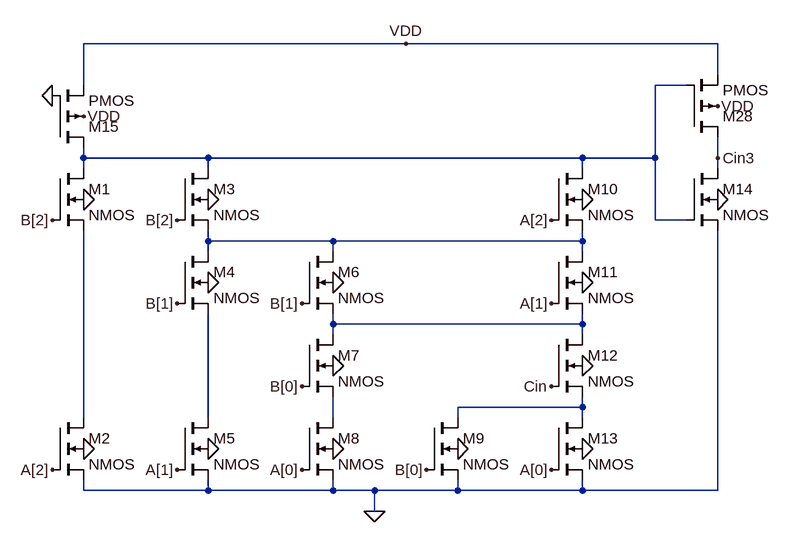
[diagram p0: schematic Carry_in3.asc]
Carry_in3.asc, the LTspice schematic file:
Version 4
SHEET 1 1284 680
WIRE 704 -320 208 -320
WIRE 1184 -320 704 -320
WIRE 1184 -272 1184 -320
WIRE 208 -256 208 -320
WIRE 1136 -256 1088 -256
WIRE 208 -144 208 -160
WIRE 400 -144 208 -144
WIRE 976 -144 400 -144
WIRE 1088 -144 1088 -256
WIRE 1088 -144 976 -144
WIRE 1184 -144 1184 -176
WIRE 208 -128 208 -144
WIRE 400 -128 400 -144
WIRE 976 -128 976 -144
WIRE 1184 -128 1184 -144
WIRE 1088 -48 1088 -144
WIRE 1136 -48 1088 -48
WIRE 400 -16 400 -32
WIRE 592 -16 400 -16
WIRE 976 -16 976 -32
WIRE 976 -16 592 -16
WIRE 400 0 400 -16
WIRE 592 0 592 -16
WIRE 976 0 976 -16
WIRE 592 112 592 96
WIRE 976 112 976 96
WIRE 976 112 592 112
WIRE 592 128 592 112
WIRE 976 128 976 112
WIRE 976 240 976 224
WIRE 976 240 784 240
WIRE 208 256 208 -32
WIRE 400 256 400 96
WIRE 592 256 592 224
WIRE 784 256 784 240
WIRE 976 256 976 240
WIRE 208 368 208 352
WIRE 400 368 400 352
WIRE 400 368 208 368
WIRE 592 368 592 352
WIRE 592 368 400 368
WIRE 656 368 592 368
WIRE 784 368 784 352
WIRE 784 368 656 368
WIRE 976 368 976 352
WIRE 976 368 784 368
WIRE 1184 368 1184 -32
WIRE 1184 368 976 368
WIRE 656 400 656 368
FLAG 976 304 0
FLAG 976 176 0
FLAG 976 48 0
FLAG 976 -80 0
FLAG 1184 -80 0
FLAG 784 304 0
FLAG 592 304 0
FLAG 592 176 0
FLAG 592 48 0
FLAG 400 48 0
FLAG 400 -80 0
FLAG 400 304 0
FLAG 208 304 0
FLAG 208 -80 0
FLAG 1184 -224 VDD
FLAG 656 400 0
FLAG 928 336 A[0]
FLAG 544 336 A[0]
FLAG 928 80 A[1]
FLAG 352 336 A[1]
FLAG 160 336 A[2]
FLAG 928 -48 A[2]
FLAG 736 336 B[0]
FLAG 544 208 B[0]
FLAG 544 80 B[1]
FLAG 352 80 B[1]
FLAG 352 -48 B[2]
FLAG 160 -48 B[2]
FLAG 928 208 Cin
FLAG 1184 -144 Cin3
FLAG 704 -320 VDD
FLAG 208 -208 VDD
FLAG 160 -240 0
SYMBOL nmos4 160 -128 R0
SYMATTR InstName M1
SYMBOL nmos4 160 256 R0
SYMATTR InstName M2
SYMBOL nmos4 352 -128 R0
SYMATTR InstName M3
SYMBOL nmos4 352 0 R0
SYMATTR InstName M4
SYMBOL nmos4 352 256 R0
SYMATTR InstName M5
SYMBOL nmos4 544 0 R0
SYMATTR InstName M6
SYMBOL nmos4 544 128 R0
SYMATTR InstName M7
SYMBOL nmos4 544 256 R0
SYMATTR InstName M8
SYMBOL nmos4 736 256 R0
SYMATTR InstName M9
SYMBOL nmos4 928 -128 R0
SYMATTR InstName M10
SYMBOL nmos4 928 0 R0
SYMATTR InstName M11
SYMBOL nmos4 928 128 R0
SYMATTR InstName M12
SYMBOL nmos4 928 256 R0
SYMATTR InstName M13
SYMBOL nmos4 1136 -128 R0
SYMATTR InstName M14
SYMBOL pmos4 160 -160 M180
SYMATTR InstName M15
SYMBOL pmos4 1136 -176 M180
SYMATTR InstName M28

The netlist it stands for:
* Carry_in3.asc
M1 N001 B[2] N005 0 NMOS
M2 N005 A[2] 0 0 NMOS
M3 N001 B[2] N002 0 NMOS
M4 N002 B[1] N006 0 NMOS
M5 N006 A[1] 0 0 NMOS
M6 N002 B[1] N003 0 NMOS
M7 N003 B[0] N007 0 NMOS
M8 N007 A[0] 0 0 NMOS
M9 N004 B[0] 0 0 NMOS
M10 N001 A[2] N002 0 NMOS
M11 N002 A[1] N003 0 NMOS
M12 N003 Cin N004 0 NMOS
M13 N004 A[0] 0 0 NMOS
M14 Cin3 N001 0 0 NMOS
M15 N001 0 VDD VDD PMOS
M28 Cin3 N001 VDD VDD PMOS
.model NMOS NMOS
.model PMOS PMOS
.lib standard.mos
.backanno
.end